# EAGLE schematic P00R5 (EAGLE 9.6.1)
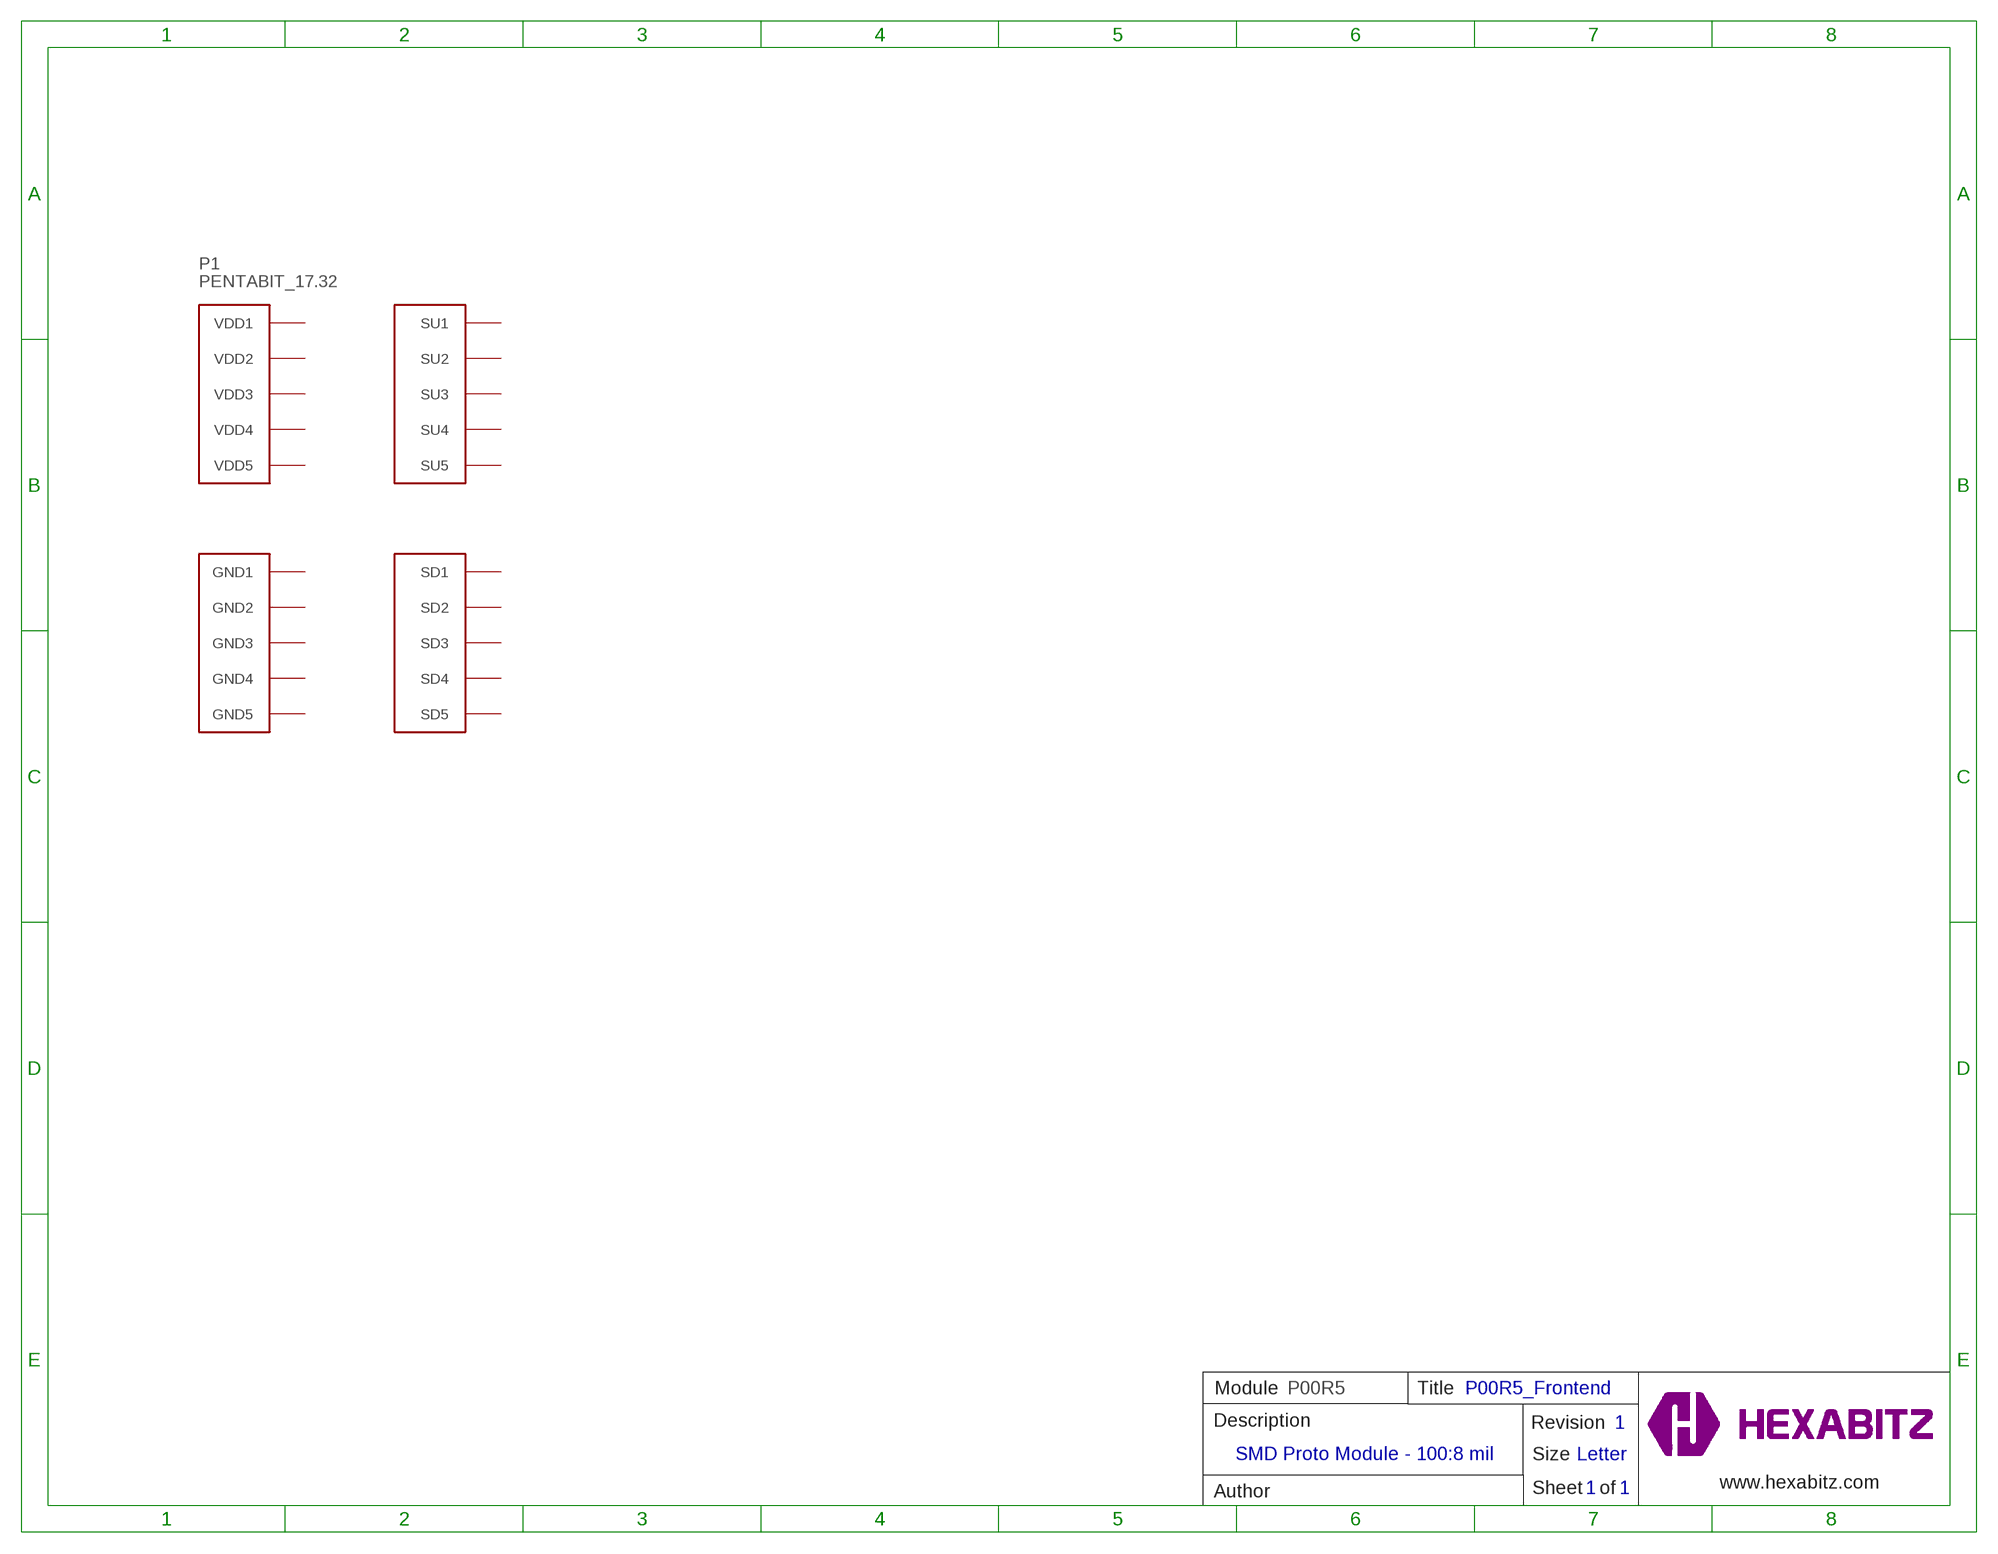
[diagram p0: schematic, sheet 1]

## Parts
P1  PENTABIT_17.32  [PENTABIT_17.32]
Unconnected: P1.PAD_PD1(SD1) P1.PAD_PD2(SD2) P1.PAD_PD3(SD3) P1.PAD_PD4(SD4) P1.PAD_PD5(SD5) P1.PAD_PU1(SU1) P1.PAD_PU2(SU2) P1.PAD_PU3(SU3) P1.PAD_PU4(SU4) P1.PAD_PU5(SU5)

## Notes on the sheet
- Module | P00R5 | Title | P00R5_Frontend
- Description | Revision | 1
- SMD Proto Module - 100:8 mil
- Size | Letter
- www.hexabitz.com
- Author | Sheet   of | 1 | 1
- C:/Users/Admin/Desktop/logodraft.bmp

## Power pins joined to a net without a drawn wire
GND1: P1.PAD_PD6(GND1)
GND2: P1.PAD_PD7(GND2)
GND3: P1.PAD_PD8(GND3)
GND4: P1.PAD_PD9(GND4)
GND5: P1.PAD_PD10(GND5)
VDD1: P1.PAD_PU6(VDD1)
VDD2: P1.PAD_PU7(VDD2)
VDD3: P1.PAD_PU8(VDD3)
VDD4: P1.PAD_PU9(VDD4)
VDD5: P1.PAD_PU10(VDD5)

## Library data of the parts
P1 = hexabitz_connectors:PENTABIT_?: Hexabitz Pentagon Module Connector Pentagon side length = 17.32mm.